# Altium schematic sheet DVI-I.SchDoc: Evaluation Board 3.2
size A3; Organization: Toradex AG; Address1: Altsagenstrasse 5; Address2: Horw; Address3: 6048; Address4: Switzerland; DocumentNumber: 18; Revision: V3.2; SheetNumber: 18; SheetTotal: 23; PageSetup: Record=PageOptions|CenterHorizontal=True|CenterVertical=True|PrintScale=0.73|XCorrection=1.00|YCorrection=1.00|PrintKind=0|BorderSize=5000000|LeftOffset=0|BottomOffset=0|Orientation=2|PaperLength=1000|PaperWidth=1000|Scale=100|PaperSource=7|PrintQuality=-4|MediaType=1|DitherType=10|PaperKind=A4|PrintScaleMode=1
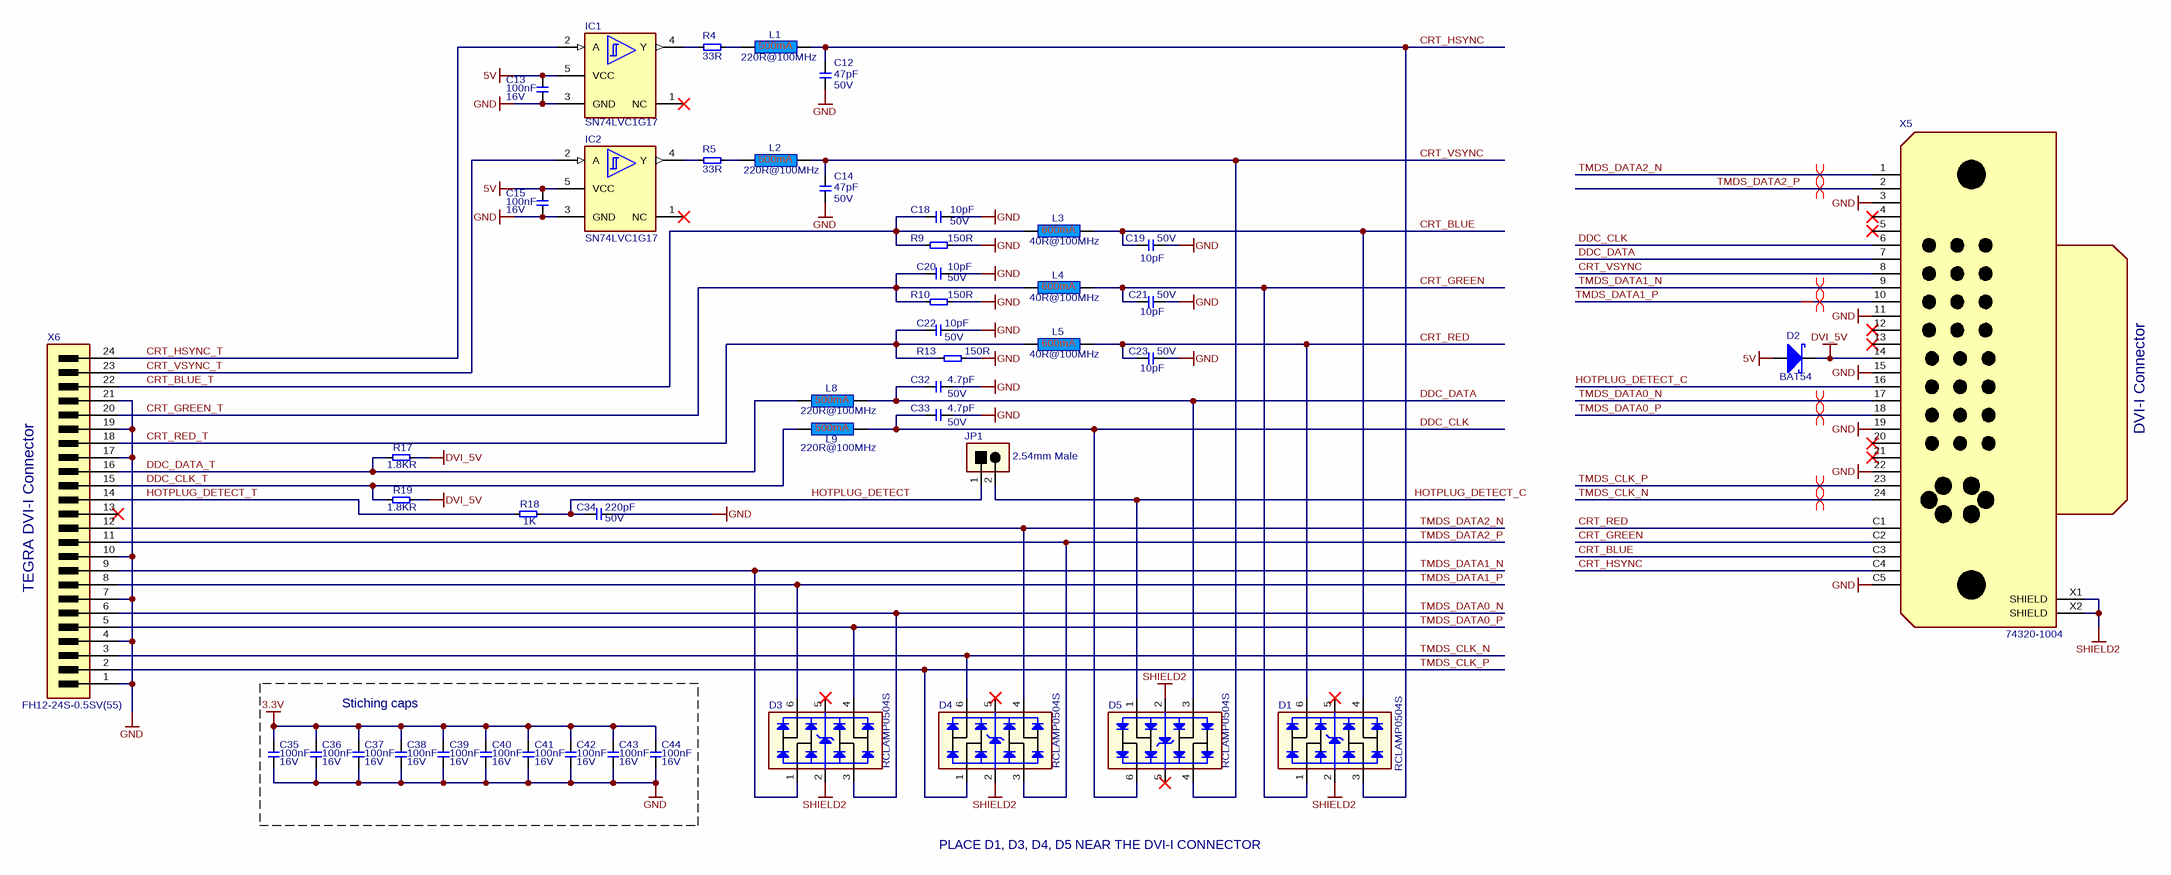
[diagram p0: DVI-I.SchDoc]

## Parts
C12  Rating: 50V  [T_CAPC0603X33N]  (hidden comment: 47pF)
C13  Rating: 16V  [T_CAPC0603X33N]  (hidden comment: 100nF)
C14  Rating: 50V  [T_CAPC0603X33N]  (hidden comment: 47pF)
C15  Rating: 16V  [T_CAPC0603X33N]  (hidden comment: 100nF)
C18  Rating: 50V  [T_CAPC0603X33N]  (hidden comment: 10pF)
C19  Rating: 50V  [T_CAPC0603X33N]  (hidden comment: 10pF)
C20  Rating: 50V  [T_CAPC0603X33N]  (hidden comment: 10pF)
C21  Rating: 50V  [T_CAPC0603X33N]  (hidden comment: 10pF)
C22  Rating: 50V  [T_CAPC0603X33N]  (hidden comment: 10pF)
C23  Rating: 50V  [T_CAPC0603X33N]  (hidden comment: 10pF)
C32  Rating: 50V  [T_CAPC0603X33N]  (hidden comment: 4.7pF)
C33  Rating: 50V  [T_CAPC0603X33N]  (hidden comment: 4.7pF)
C34  Rating: 50V  [T_CAPC0603X33N]  (hidden comment: 220pF)
C35  Rating: 16V  [T_CAPC0603X33N]  (hidden comment: 100nF)
C36  Rating: 16V  [T_CAPC0603X33N]  (hidden comment: 100nF)
C37  Rating: 16V  [T_CAPC0603X33N]  (hidden comment: 100nF)
C38  Rating: 16V  [T_CAPC0603X33N]  (hidden comment: 100nF)
C39  Rating: 16V  [T_CAPC0603X33N]  (hidden comment: 100nF)
C40  Rating: 16V  [T_CAPC0603X33N]  (hidden comment: 100nF)
C41  Rating: 16V  [T_CAPC0603X33N]  (hidden comment: 100nF)
C42  Rating: 16V  [T_CAPC0603X33N]  (hidden comment: 100nF)
C43  Rating: 16V  [T_CAPC0603X33N]  (hidden comment: 100nF)
C44  Rating: 16V  [T_CAPC0603X33N]  (hidden comment: 100nF)
D1  RCLAMP0504S  [T_SOT95P285X90-6N]
D2  BAT54  [SOT95P230X110-3N]
D3  RCLAMP0504S  [T_SOT95P285X90-6N]
D4  RCLAMP0504S  [T_SOT95P285X90-6N]
D5  RCLAMP0504S  [T_SOT95P285X90-6N]
IC1  SN74LVC1G17  [SOT65P210X110-5N]
IC2  SN74LVC1G17  [SOT65P210X110-5N]
JP1  TSW-101-07-G-D  [T_Samtec_TSW-101-07-G-D]  (value not drawn)
L1  220R@100MHz  [INDC1608X95N]
L2  220R@100MHz  [INDC1608X95N]
L3  40R@100MHz  [INDC1608X95N]
L4  40R@100MHz  [INDC1608X95N]
L5  40R@100MHz  [INDC1608X95N]
L8  220R@100MHz  [INDC1608X95N]
L9  220R@100MHz  [INDC1608X95N]
R4  33R  [t_RESC0603X30N]
R5  33R  [t_RESC0603X30N]
R9  150R  [t_RESC0603X30N]
R10  150R  [t_RESC0603X30N]
R13  150R  [t_RESC0603X30N]
R17  value 1.8KR  [t_RESC0603X30N]  (hidden comment: 1.8K)
R18  1K  [t_RESC0603X30N]
R19  value 1.8KR  [t_RESC0603X30N]  (hidden comment: 1.8K)
X5  Manufacturer Part No.: 74320-1004  [T_MOLEX_74320-1004]  (hidden comment: CON-Molex-74320-1004-31)
X6  FH12-24S-0.5SV(55)  [T_Hirose_FH12-24S-0.5SV(55)]

## Blocks framed on the sheet
Stiching caps: C35-C44

## Nets
3.3V: C35.2 C36.2 C37.2 C38.2 C39.2 C40.2 C41.2 C42.2 C43.2 C44.2
5V: C13.2 C15.2 D2.1 IC1.5(VCC) IC2.5(VCC)
DVI_5V: D2.3 R17.1 R19.1 X5.14(VDD_DVI)
GND: C12.2 C13.1 C14.2 C15.1 C18.2 C19.2 C20.2 C21.2 C22.2 C23.2 C32.2 C33.2 C34.2 C35.1 C36.1 C37.1 C38.1 C39.1 C40.1 C41.1 C42.1 C43.1 C44.1 IC1.3(GND) IC2.3(GND) R9.2 R10.2 R13.2 X5.3(GND) X5.11(GND) X5.15(GND) X5.19(GND) X5.22(GND) X5.C5(GND) X6.1(GND) X6.4(GND) X6.7(GND) X6.10(GND) X6.17(GND) X6.19(GND) X6.21(GND)
SHIELD2: D1.2 D3.2 D4.2 D5.2 X5.X1(SHIELD) X5.X2(SHIELD)
CRT_BLUE: C19.1 D1.4 L3.2 X5.C3(CRT_BLUE)
CRT_BLUE_T: C18.1 L3.1 R9.1 X6.22(CRT_BLUE)
CRT_GREEN: C21.1 D1.1 L4.2 X5.C2(CRT_GREEN)
CRT_GREEN_T: C20.1 L4.1 R10.1 X6.20(CRT_GREEN)
CRT_HSYNC: C12.1 D1.3 L1.2 X5.C4(CRT_HSYNC)
CRT_HSYNC_T: IC1.2(A) X6.24(CRT_HSYNC)
CRT_RED: C23.1 D1.6 L5.2 X5.C1(CRT_RED)
CRT_RED_T: C22.1 L5.1 R13.1 X6.18(CRT_RED)
CRT_VSYNC: C14.1 D5.4 L2.2 X5.8(CRT_VSYNC)
CRT_VSYNC_T: IC2.2(A) X6.23(CRT_VSYNC)
DDC_CLK: C33.1 D5.6 L9.2 X5.6(DDC_CLK)
DDC_CLK_T: L9.1 R19.2 X6.15(DDC_CLK)
DDC_DATA: C32.1 D5.3 L8.2 X5.7(DDC_DATA)
DDC_DATA_T: L8.1 R17.2 X6.16(DDC_DATA)
HOTPLUG_DETECT: C34.1 JP1.1 R18.2
HOTPLUG_DETECT_C: D5.1 JP1.2 X5.16(HOTPLUG_DETECT)
HOTPLUG_DETECT_T: R18.1 X6.14(HOTPLUG_DETECT)
TMDS_CLK_N: D4.6 X5.24(TMDS_CLK_N) X6.3(TMDS_CLK_N)
TMDS_CLK_P: D4.1 X5.23(TMDS_CLK_P) X6.2(TMDS_CLK_P)
TMDS_DATA0_N: D3.3 X5.17(TMDS_DATA0_N) X6.6(TMDS_DATA0_N)
TMDS_DATA0_P: D3.4 X5.18(TMDS_DATA0_P) X6.5(TMDS_DATA0_P)
TMDS_DATA1_N: D3.1 X5.9(TMDS_DATA1_N) X6.9(TMDS_DATA1_N)
TMDS_DATA1_P: D3.6 X5.10(TMDS_DATA1_P) X6.8(TMDS_DATA1_P)
TMDS_DATA2_N: D4.4 X5.1(TMDS_DATA2_N) X6.12(TMDS_DATA2_N)
TMDS_DATA2_P: D4.3 X5.2(TMDS_DATA2_P) X6.11(TMDS_DATA2_P)
NetIC1_4: IC1.4(Y) R4.1
NetIC2_4: IC2.4(Y) R5.1
NetL1_1: L1.1 R4.2
NetL2_1: L2.1 R5.2

Not connected (* = marked no-connect by the designer): D1 5*; D3 5*; D4 5*; D5 5*; IC1 1(NC)*; IC2 1(NC)*; X5 4(TMDS_DATA4_N)* 5(TMDS_DATA4_P)* 12(TMDS_DATA3_N)* 13(TMDS_DATA3_P)* 20(TMDS_DATA5_N)* 21(TMDS_DATA5_P)*; X6 13(VDD)*

## Layout directives
differential pair: TMDS_CLK_N, TMDS_CLK_P, TMDS_DATA0_N, TMDS_DATA0_P, TMDS_DATA1_N, TMDS_DATA1_P, TMDS_DATA2_N, TMDS_DATA2_P

## Notes on the sheet
- DVI-I Connector
- (near JP1) 2.54mm Male
- (near X6) TEGRA DVI-I Connector
- PLACE D1, D3, D4, D5 NEAR THE DVI-I CONNECTOR
- Title
- Size:
- Date:
- A3
- Number:
- Time:
- Revision:
- Sheet
- of
- File:

## Library data of the parts
C12 C14 = C-NP0-47pF-50V-10%-0603: Capacitor Ceramic NP0 47pF 50V 10% 0603; Tolerance: 10%; Type: NP0; Value: 47pF
C13 C15 C35-C44 = C-X7R-100nF-16V-10%-0603: Capacitor Ceramic X7R 100nF 16V 10% 0603; Tolerance: 10%; Type: X7R; Value: 100nF
C18-C23 = C-NP0-10pF-50V-10%-0603: Capacitor Ceramic NP0 10pF 50V 10% 0603; Tolerance: 10%; Type: NP0; Value: 10pF
C32 C33 = C-NP0-4.7pF-25V-10%-0603: Capacitor Ceramic NP0  4.7pF 25V 10% 0603; Tolerance: 10%; Type: NP0; Value: 4.7pF
C34 = C-X7R-220pF-50V-20%-0603: Capacitor Ceramic X7R 220pF 50V 20% 0603; Tolerance: 20%; Type: X7R; Value: 220pF
D1 D3-D5 = D-Semtech-RClamp0504S: TVS Array low cap; Manufacturer Name: Semtech; Manufacturer Part No.: RCLAMP0504S
D2 = D-Philips-BAT54-Schottky: BAT54 Schottky Diode; Manufacturer Name: Philips; Manufacturer Part No.: BAT54
IC1 IC2 = IC-TI-SN74LVC1G17: Single Schmitt-Trigger Buffer; Manufacturer Name: Texas Instruments; Manufacturer Part No.: SN74LVC1G17
JP1 = CON-Samtec-TSW-101-07-G-D: Header male, 1x2 Pins, 2.54 mm pitch; Manufacturer Name: Samtec; Pitch: 2.54 mm; No. of ways: 1x2; Manufacturer Part no.: TSW-101-07-G-D
L1 L2 L8 L9 = L-220R@100MHz-500mA-25%-0603: 220R@100MHz 500mA EMI FILTER; Tolerance: 25%; Rating: 500mA; Value: 220R@100MHz
L3-L5 = L-TDK-MMZ1608S400A-40R@100MHz-600mA-25%-0603: 40R@100MHz 600mA EMI FILTER; Manufacturer Name: TDK; Tolerance: 25%; Rating: 600mA; Manufacturer Part No.: MMZ1608S400A; Value: 40R@100MHz
R4 R5 = R-33R-63mW-5%-0603: Resistor 33 ohm 63mW 5% 0603; Rating: 63mW; Tolerance: 5%; Value: 33R
R9 R10 R13 = R-150R-63mW-1%-0603: Resistor 150 ohm 63mW 1% 0603; Rating: 63mW; Tolerance: 1%; Value: 150R
R17 R19 = R-1.8KR-63mW-5%-0603: Resistor 1.8 Kohm 63mW 5% 0603; Rating: 63mW; Tolerance: 5%
R18 = R-1KR-63mW-5%-0603: Resistor 1 Kohm 63mW 5% 0603; Rating: 63mW; Tolerance: 5%; Value: 1K
X5 = CON-Molex-74320-1004-31: DVI Connector; Manufacturer Name: Molex; No. of ways: 31
X6 = CON-Hirose-FH12-24S-0.5SV(55)-0.5mm: 0.50mm Pitch FFC/FPC Vertical DVI Connector; Manufacturer Name: Hirose; No. of ways: 24; Pitch: 0.5mm; Manufacturer Part No.: FH12-24S-0.5SV(55)